# EAGLE schematic h-bridge2-smd-002 (EAGLE 7.2.0)
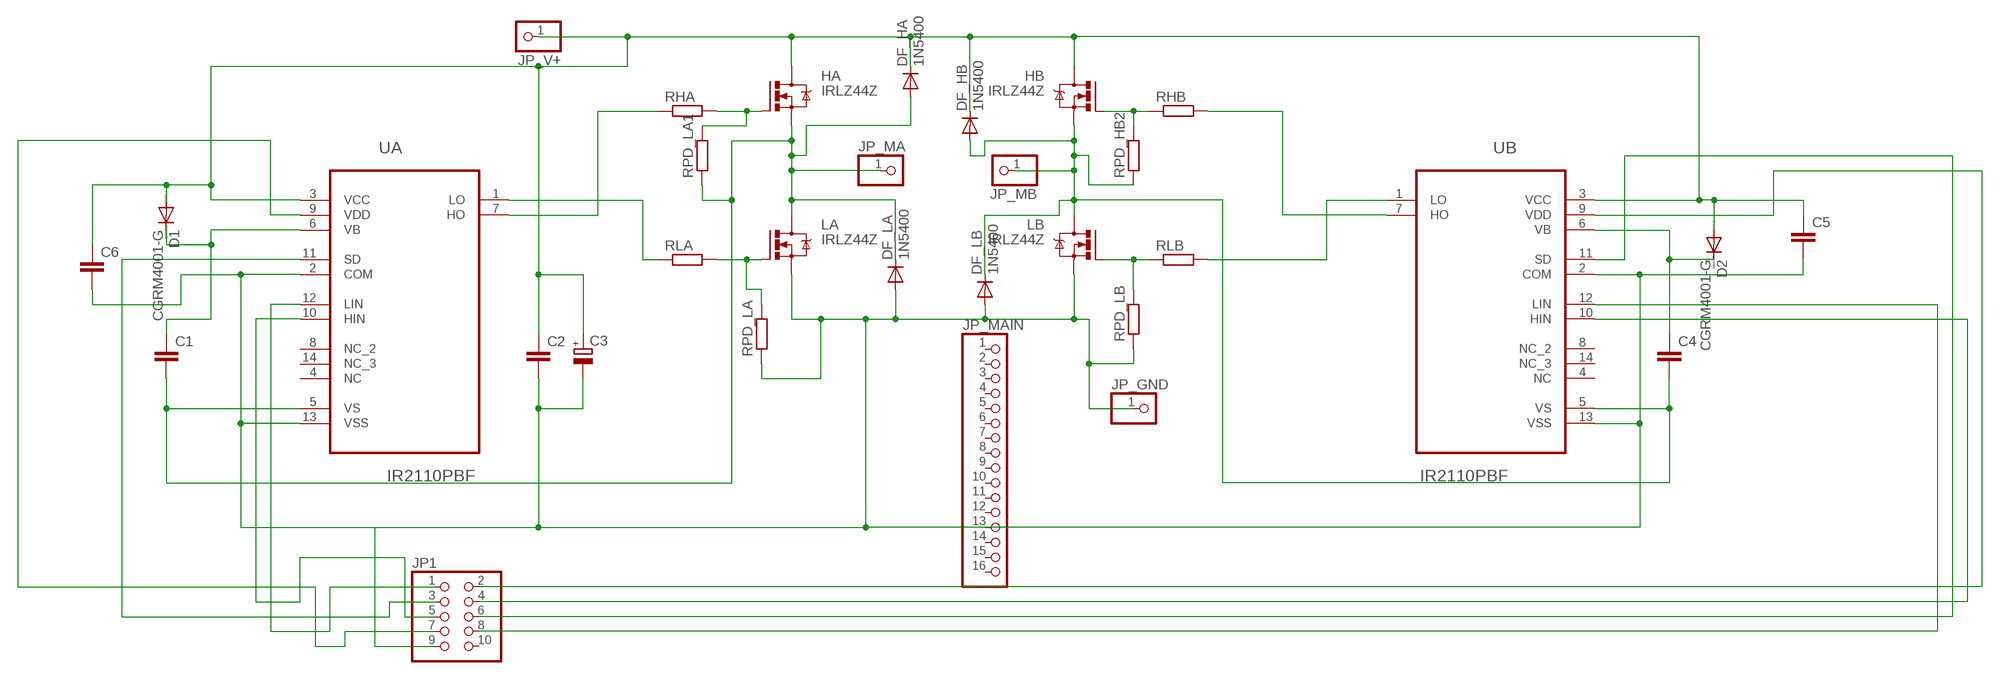
[diagram p0: schematic, sheet 1]

## Parts
C1  C-EUC4532  [C4532]
C2  C-EU025-024X044  [C025-024X044]
C3  CPOL-EUE5-13  [E5-13]
C4  C-EUC4532  [C4532]
C5  C-EUC4532  [C4532]
C6  C-EUC4532  [C4532]
D1  CGRM4001-G  [SOD-123_MINI-SMA]
D2  CGRM4001-G  [SOD-123_MINI-SMA]
DF_HA  1N5400  [DO201-15]
DF_HB  1N5400  [DO201-15]
DF_LA  1N5400  [DO201-15]
DF_LB  1N5400  [DO201-15]
HA  IRLZ44Z  [TO220BH]
HB  IRLZ44Z  [TO220BH]
JP1  PINHD-2X5  [2X05]
JP_GND  PINHD-1X1  [1X01]
JP_MA  PINHD-1X1  [1X01]
JP_MAIN  PINHD-1X16  [1X16]
JP_MB  PINHD-1X1  [1X01]
JP_V+  PINHD-1X1  [1X01]
LA  IRLZ44Z  [TO220BH]
LB  IRLZ44Z  [TO220BH]
RHA  R-EU_R1206  [R1206]
RHB  R-EU_R1206  [R1206]
RLA  R-EU_R1206  [R1206]
RLB  R-EU_R1206  [R1206]
RPD_HB2  R-EU_R1206  [R1206]
RPD_LA  R-EU_R1206  [R1206]
RPD_LA1  R-EU_R1206  [R1206]
RPD_LB  R-EU_R1206  [R1206]
UA  IR2110PBF  [DIP254P762X533-14]
UB  IR2110PBF  [DIP254P762X533-14]

## Nets
N$4: C2.2 C3.- C5.2 C6.2 DF_LA.A DF_LB.A JP1.9 JP_GND.1 LA.S LB.S RPD_LA.1 RPD_LB.1 UA.2(COM) UA.13(VSS) UB.2(COM) UB.13(VSS)
N$5: LA.G RLA.2 RPD_LA.2
N$6: HA.G RHA.2 RPD_LA1.2
N$7: HB.G RHB.1 RPD_HB2.2
N$8: LB.G RLB.1 RPD_LB.2
N$9: RHA.1 UA.7(HO)
N$10: RLA.1 UA.1(LO)
N$11: RHB.2 UB.7(HO)
N$12: RLB.2 UB.1(LO)
N$13: C2.1 C3.+ C5.1 C6.1 D1.A D2.A DF_HA.C DF_HB.C HA.D HB.D JP_V+.1 UA.3(VCC) UB.3(VCC)
N$14: C1.1 D1.C UA.6(VB)
N$16: C4.2 DF_HB.A DF_LB.C HB.S JP_MB.1 LB.D RPD_HB2.1 UB.5(VS)
N$17: C1.2 DF_HA.A DF_LA.C HA.S JP_MA.1 LA.D RPD_LA1.1 UA.5(VS)
N$18: C4.1 D2.C UB.6(VB)
N$20: JP1.3 UA.11(SD)
N$22: JP1.7 UA.9(VDD)
N$23: JP1.5 UA.10(HIN)
N$24: JP1.1 UA.12(LIN)
N$25: JP1.2 UB.9(VDD)
N$26: JP1.4 UB.10(HIN)
N$27: JP1.6 UB.11(SD)
N$28: JP1.8 UB.12(LIN)
Unconnected: JP1.10 JP_MAIN.1 JP_MAIN.2 JP_MAIN.3 JP_MAIN.4 JP_MAIN.5 JP_MAIN.6 JP_MAIN.7 JP_MAIN.8 JP_MAIN.9 JP_MAIN.10 JP_MAIN.11 JP_MAIN.12 JP_MAIN.13 JP_MAIN.14 JP_MAIN.15 JP_MAIN.16 UA.4(NC) UA.8(NC_2) UA.14(NC_3) UB.4(NC) UB.8(NC_2) UB.14(NC_3)

## Library data of the parts
C1 C2 C4-C6 = rcl:C-EU: CAPACITOR, European symbol
C3 = rcl:CPOL-EU: POLARIZED CAPACITOR, European symbol
D1 D2 = diode:CGRM400*-G: Molded plasitc,JEDEC SOD-123/Mini SMA Source: Comchip CGRM4001-G.pdf
DF_HA DF_HB DF_LA DF_LB = dbg-misc:1N5400: DIODE standard rectifier, 3 A, 50 V (Motorola)
HA HB LA LB = transistor-power:IRLZ44Z: N-Channel HEXFET® Power MOSFET Logic Level AUTOMOTIVE MOSFET Source: http://www.irf.com/product-info/datasheets/data/irlz44zpbf.pdf
JP1 = pinhead:PINHD-2X5: PIN HEADER
JP_GND JP_MA JP_MB JP_V+ = dbg-misc:PINHD-1X1: PIN HEADER
JP_MAIN = pinhead:PINHD-1X16: PIN HEADER
RHA RHB RLA RLB RPD_HB2 RPD_LA RPD_LA1 RPD_LB = rcl:R-EU_: RESISTOR, European symbol
UA UB = ir2110:IR2110PBF: HIGH AND LOW SIDE DRIVER; MPN: IR2110PBF; OC_FARNELL: 8638837; OC_NEWARK: 63J7859; PACKAGE: PDIP-14; SUPPLIER: INTERNATIONAL RECTIFIER